# EAGLE design frankfurt_eth_arm (EAGLE 6.6.0)

## Sheet 1 of 3
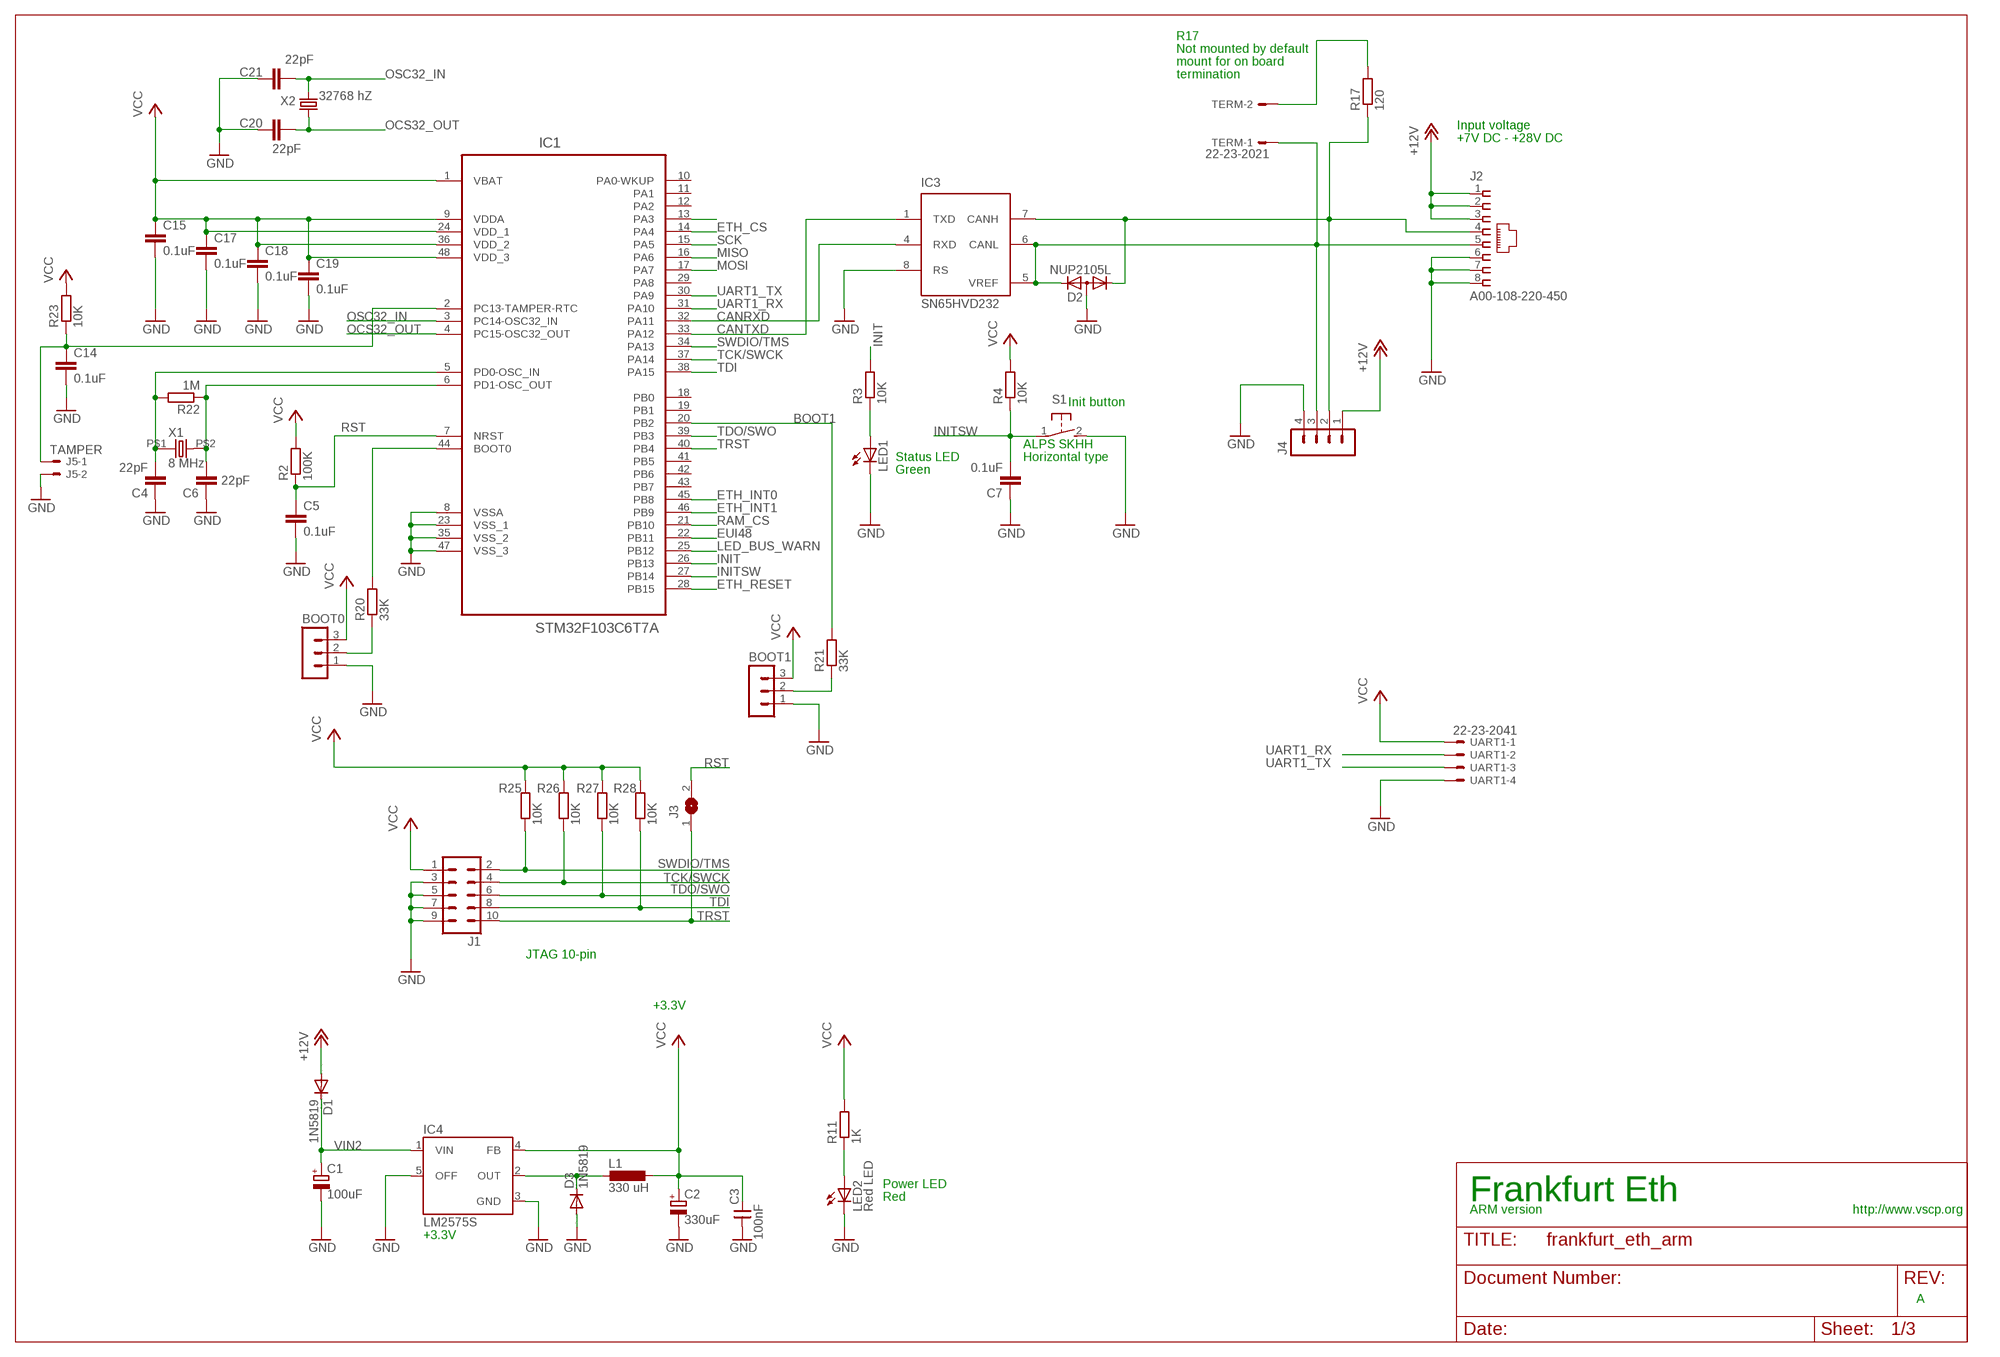
[diagram p0: schematic, sheet 1]

### Parts
BOOT0  MA03-1  [MA03-1]
BOOT1  MA03-1  [MA03-1]
C1  100uF  CPOL-EUD  [PANASONIC_D]
C2  330uF  CPOL-EUD  [PANASONIC_D]
C3  100nF  CNP-0805  [0805]
C4  22pF  C-EUC0805  [C0805]
C5  0.1uF  C-EUC0805  [C0805]
C6  22pF  C-EUC0805  [C0805]
C7  0.1uF  C-EUC0805  [C0805]
C14  0.1uF  C-EUC0805  [C0805]
C15  0.1uF  C-EUC0805  [C0805]
C17  0.1uF  C-EUC0805  [C0805]
C18  0.1uF  C-EUC0805  [C0805]
C19  0.1uF  C-EUC0805  [C0805]
C20  22pF  C-EUC0805  [C0805]
C21  22pF  C-EUC0805  [C0805]
D1  1N5819  DIODE-SOD123  [SOD123]
D2  NUP2105L  DIODE-2CA|ACSOT23  [SOT23]
D3  1N5819  DIODE-SOD123  [SOD123]
IC1  STM32F103C6T7A  [QFP50P900X900X160-48N]
IC3  SN65HVD232  MCP2551SN  [SO-08]
IC4  LM2575S  [TO263-5]
J1  MA05-2  [MA05-2]
J2  A00-108-220-450  [RJ-45]
J3  SJ  [SJ]
J4  MA04-1  [MA04-1]
J5  TAMPER  22-23-2021  [22-23-2021]
L1  330 uH  DO3316P  [DO3316P]
LED1  LEDCHIP-LED0805  [CHIP-LED0805]
LED2  Red LED  LEDCHIP-LED0805  [CHIP-LED0805]
R2  100K  R-EU_R0805  [R0805]
R3  10K  R-EU_R0805  [R0805]
R4  10K  R-EU_R0805  [R0805]
R11  1K  R-EU_R0805  [R0805]
R17  120  R-EU_R0805  [R0805]
R20  33K  R-EU_R0805  [R0805]
R21  33K  R-EU_R0805  [R0805]
R22  1M  R-EU_R0805  [R0805]
R23  10K  R-EU_R0805  [R0805]
R25  10K  R-EU_R0805  [R0805]
R26  10K  R-EU_R0805  [R0805]
R27  10K  R-EU_R0805  [R0805]
R28  10K  R-EU_R0805  [R0805]
S1  31-XX  [B3F-31XX]
TERM  22-23-2021  [22-23-2021]
UART1  22-23-2041  [22-23-2041]
X1  8 MHz  HC-49S  [9C]
X2  32768 hZ  CRYSTALTC26H  [TC26H]

### Nets
+12V: D1.A J2.1 J2.2 J2.3 J4.1
_BOOT0: BOOT0.2 R20.1
_BOOT1: BOOT1.2 R21.1
BOOT0: IC1.44(BOOT0) R20.2
BOOT1: IC1.20(PB2) R21.2
CANL: D2.2(K2) IC3.5(VREF) IC3.6(CANL) J2.5 J4.3 TERM.1
CANRXD: IC1.32(PA11) IC3.4(RXD)
CANTXD: IC1.33(PA12) IC3.1(TXD)
ETH_CS: IC1.14(PA4) ; also sheet 2
ETH_INT0: IC1.45(PB8) ; also sheet 2
ETH_INT1: IC1.46(PB9) ; also sheet 2
ETH_RESET: IC1.28(PB15) ; also sheet 2
EUI48: IC1.22(PB11) ; also sheet 3
GND: BOOT0.1 BOOT1.1 C1.- C2.- C3.1 C4.1 C5.2 C6.1 C7.1 C14.2 C15.2 C17.2 C18.2 C19.2 C20.1 C21.1 D2.3(A) D3.A IC1.8(VSSA) IC1.23(VSS_1) IC1.35(VSS_2) IC1.47(VSS_3) IC3.8(RS) IC4.3(GND) IC4.5(OFF) J1.3 J1.5 J1.7 J1.9 J2.6 J2.7 J2.8 J4.4 J5.2 LED1.C LED2.C S1.2(S) UART1.4 ; also sheet 2,3
INIT: IC1.26(PB13) R3.2
INITSW: C7.2 IC1.27(PB14) R4.1 S1.1(P)
LED_BUS_WARN: IC1.25(PB12)
MISO: IC1.16(PA6) ; also sheet 2,3
MOSI: IC1.17(PA7) ; also sheet 2,3
N$1: D3.C IC4.2(OUT) L1.1
N$2: C4.2 IC1.5(PD0-OSC_IN) R22.2 X1.P$1
N$5: LED1.A R3.1
N$7: C6.2 IC1.6(PD1-OSC_OUT) R22.1 X1.P$2
N$11: R17.2 TERM.2
N$20: LED2.A R11.1
N$22: D2.1(K1) IC3.7(CANH) J2.4 J4.2 R17.1
N$27: C14.1 IC1.2(PC13-TAMPER-RTC) J5.1 R23.1
OCS32_OUT: C20.2 IC1.4(PC15-OSC32_OUT) X2.1
OSC32_IN: C21.2 IC1.3(PC14-OSC32_IN) X2.2
RAM_CS: IC1.21(PB10) ; also sheet 3
ROM_CS1: IC1.13(PA3) ; also sheet 3
RST: C5.1 IC1.7(NRST) J3.2 R2.1
SCK: IC1.15(PA5) ; also sheet 2,3
SWDIO/TMS: IC1.34(PA13) J1.2 R25.1
TCK/SWCK: IC1.37(PA14) J1.4 R26.1
TDI: IC1.38(PA15) J1.8 R28.1
TDO/SWO: IC1.39(PB3) J1.6 R27.1
TRST: IC1.40(PB4) J1.10 J3.1
UART1_RX: IC1.31(PA10) UART1.2
UART1_TX: IC1.30(PA9) UART1.3
VCC: BOOT0.3 BOOT1.3 C2.+ C3.2 C15.1 C17.1 C18.1 C19.1 IC1.1(VBAT) IC1.9(VDDA) IC1.24(VDD_1) IC1.36(VDD_2) IC1.48(VDD_3) IC4.4(FB) J1.1 L1.2 R2.2 R4.2 R11.2 R23.2 R25.2 R26.2 R27.2 R28.2 UART1.1 ; also sheet 2,3
VIN2: C1.+ D1.C IC4.1(VIN)
Unconnected: IC1.10(PA0-WKUP) IC1.11(PA1) IC1.12(PA2) IC1.18(PB0) IC1.19(PB1) IC1.29(PA8) IC1.41(PB5) IC1.42(PB6) IC1.43(PB7)

### Notes on the sheet
- R17
- Not mounted by default
- mount for on board
- termination
- Input voltage
- +7V DC - +28V DC
- Init button
- ALPS SKHH
- Status LED | Horizontal type
- Green
- JTAG 10-pin
- +3.3V
- Power LED
- Red | Frankfurt Eth
- ARM version | http://www.vscp.org
- +3.3V
- A

## Sheet 2 of 3
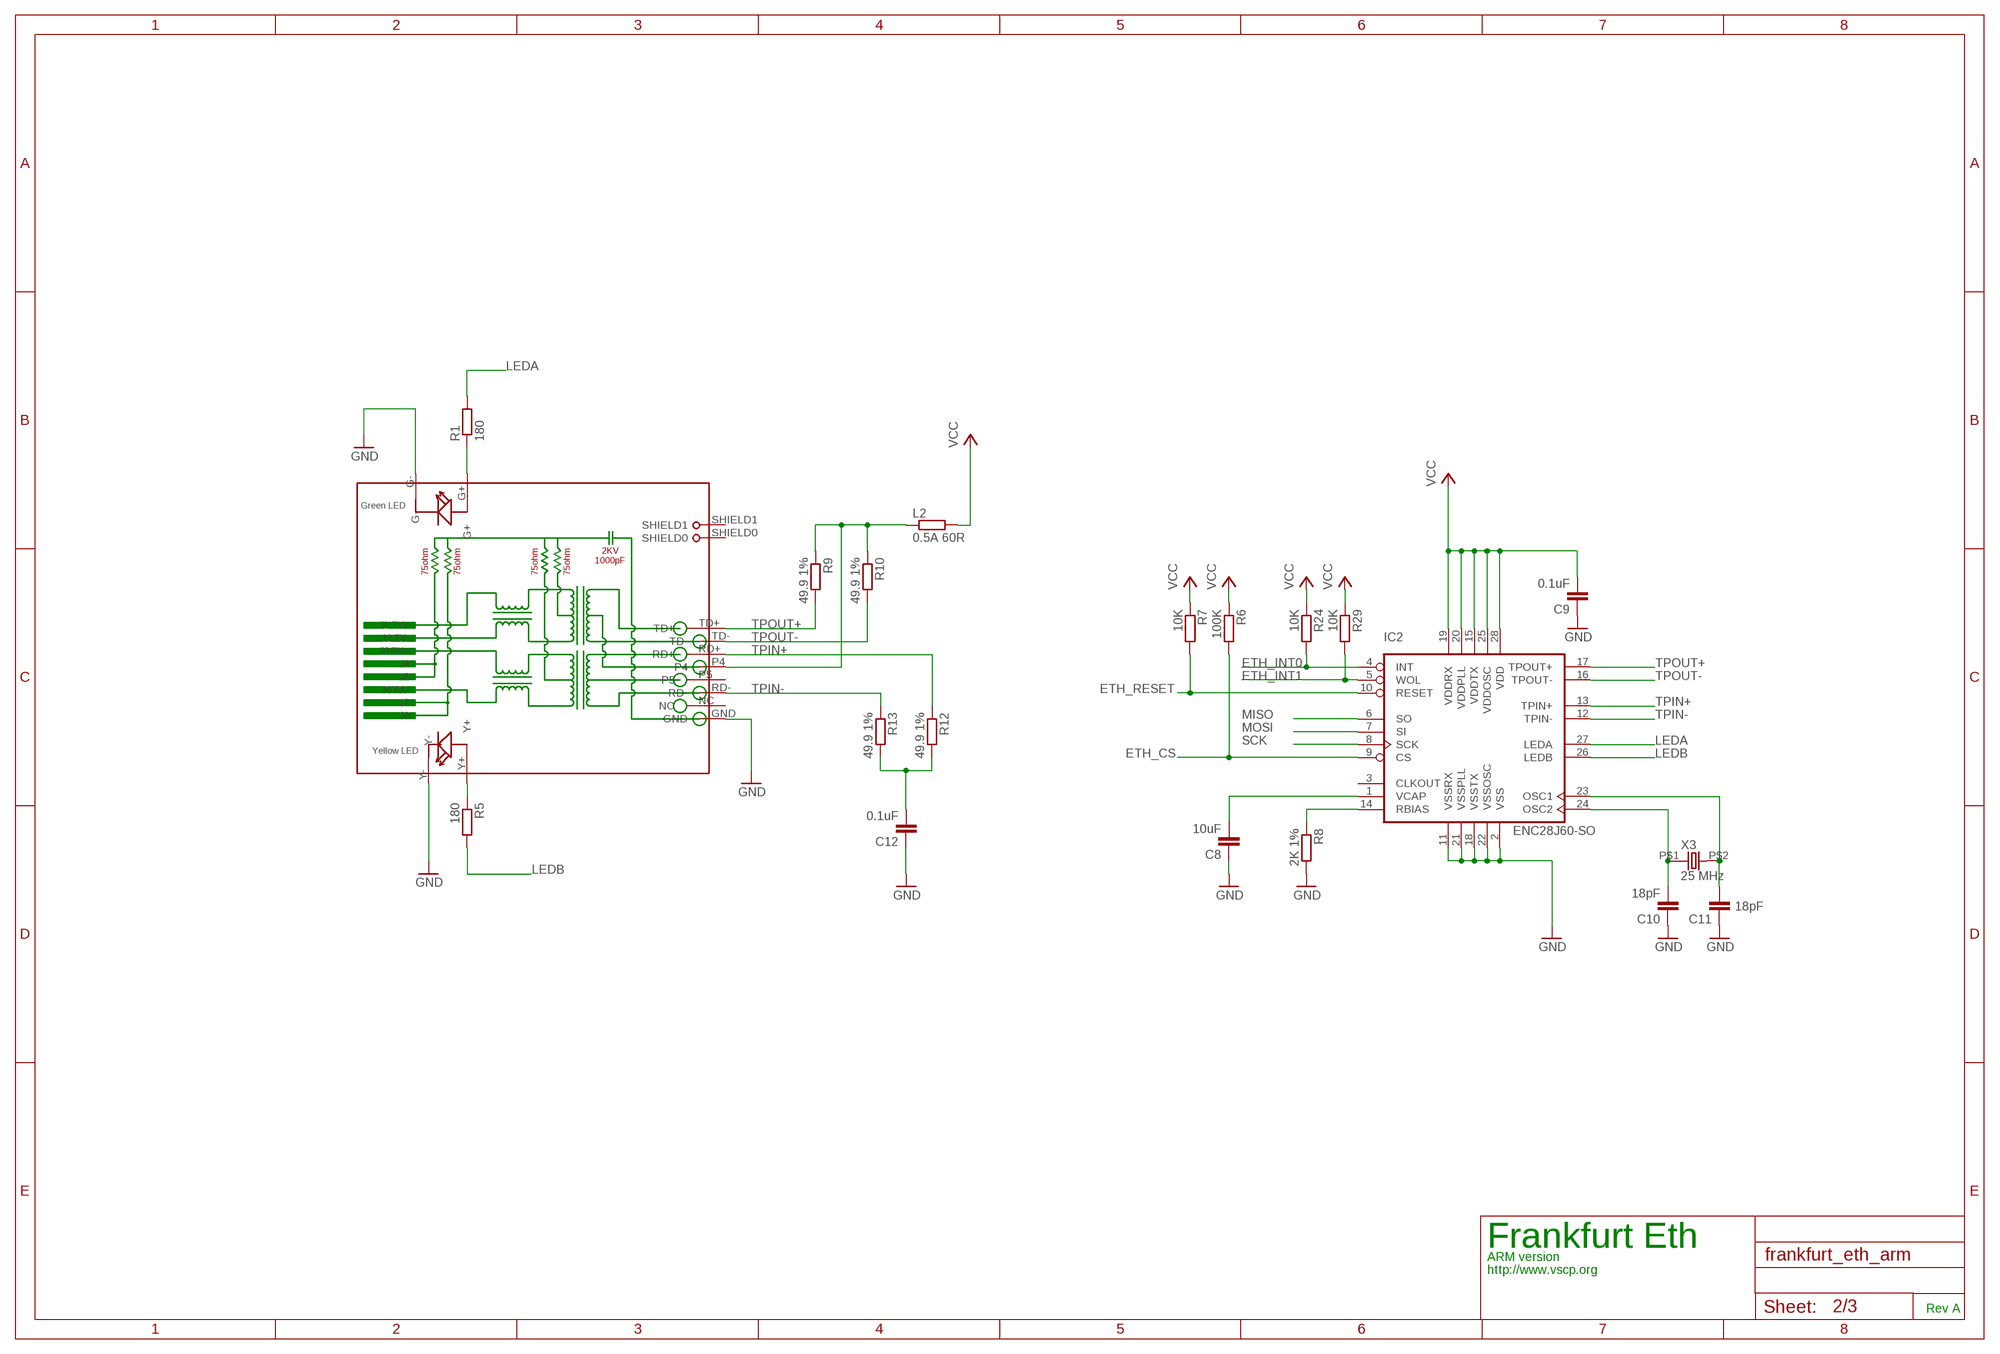
[diagram p1: schematic, sheet 2]

### Parts
C8  10uF  C-EUC0805  [C0805]
C9  0.1uF  C-EUC0805  [C0805]
C10  18pF  C-EUC0805  [C0805]
C11  18pF  C-EUC0805  [C0805]
C12  0.1uF  C-EUC0805  [C0805]
IC2  ENC28J60-SO  [SO28W]
L2  0.5A 60R  R-EU_R0805  [R0805]
R1  180  R-EU_R0805  [R0805]
R5  180  R-EU_R0805  [R0805]
R6  100K  R-EU_R0805  [R0805]
R7  10K  R-EU_R0805  [R0805]
R8  2K 1%  R-EU_R0805  [R0805]
R9  49.9 1%  R-EU_R0805  [R0805]
R10  49.9 1%  R-EU_R0805  [R0805]
R12  49.9 1%  R-EU_R0805  [R0805]
R13  49.9 1%  R-EU_R0805  [R0805]
R24  10K  R-EU_R0805  [R0805]
R29  10K  R-EU_R0805  [R0805]
RJ1  HR911105A  [HR911105A]
X3  25 MHz  HC-49S  [9C]

### Nets
ETH_CS: IC2.9(CS) R6.2 ; also sheet 1
ETH_INT0: IC2.4(INT) R24.2 ; also sheet 1
ETH_INT1: IC2.5(WOL) R29.2 ; also sheet 1
ETH_RESET: IC2.10(RESET) R7.2 ; also sheet 1
GND: C8.1 C9.1 C10.1 C11.1 C12.1 IC2.2(VSS) IC2.11(VSSRX) IC2.18(VSSTX) IC2.21(VSSPLL) IC2.22(VSSOSC) R8.2 RJ1.G- RJ1.GND RJ1.Y- ; also sheet 1,3
LEDA: IC2.27(LEDA) R1.2
LEDB: IC2.26(LEDB) R5.2
MISO: IC2.6(SO) ; also sheet 1,3
MOSI: IC2.7(SI) ; also sheet 1,3
N$8: R1.1 RJ1.G+
N$9: C8.2 IC2.1(VCAP)
N$10: R5.1 RJ1.Y+
N$13: IC2.14(RBIAS) R8.1
N$15: C10.2 IC2.24(OSC2) X3.P$1
N$16: C11.2 IC2.23(OSC1) X3.P$2
N$17: C12.2 R12.2 R13.2
N$19: L2.1 R9.1 R10.1 RJ1.P4
SCK: IC2.8(SCK) ; also sheet 1,3
TPIN+: IC2.13(TPIN+) R12.1 RJ1.RD+
TPIN-: IC2.12(TPIN-) R13.1 RJ1.RD-
TPOUT+: IC2.17(TPOUT+) R9.2 RJ1.TD+
TPOUT-: IC2.16(TPOUT-) R10.2 RJ1.TD-
VCC: C9.2 IC2.15(VDDTX) IC2.19(VDDRX) IC2.20(VDDPLL) IC2.25(VDDOSC) IC2.28(VDD) L2.2 R6.1 R7.1 R24.1 R29.1 ; also sheet 1,3
Unconnected: IC2.3(CLKOUT) RJ1.NC RJ1.P5 RJ1.SHIELD0 RJ1.SHIELD1

### Notes on the sheet
- Frankfurt Eth
- ARM version
- http://www.vscp.org
- Rev A

## Sheet 3 of 3
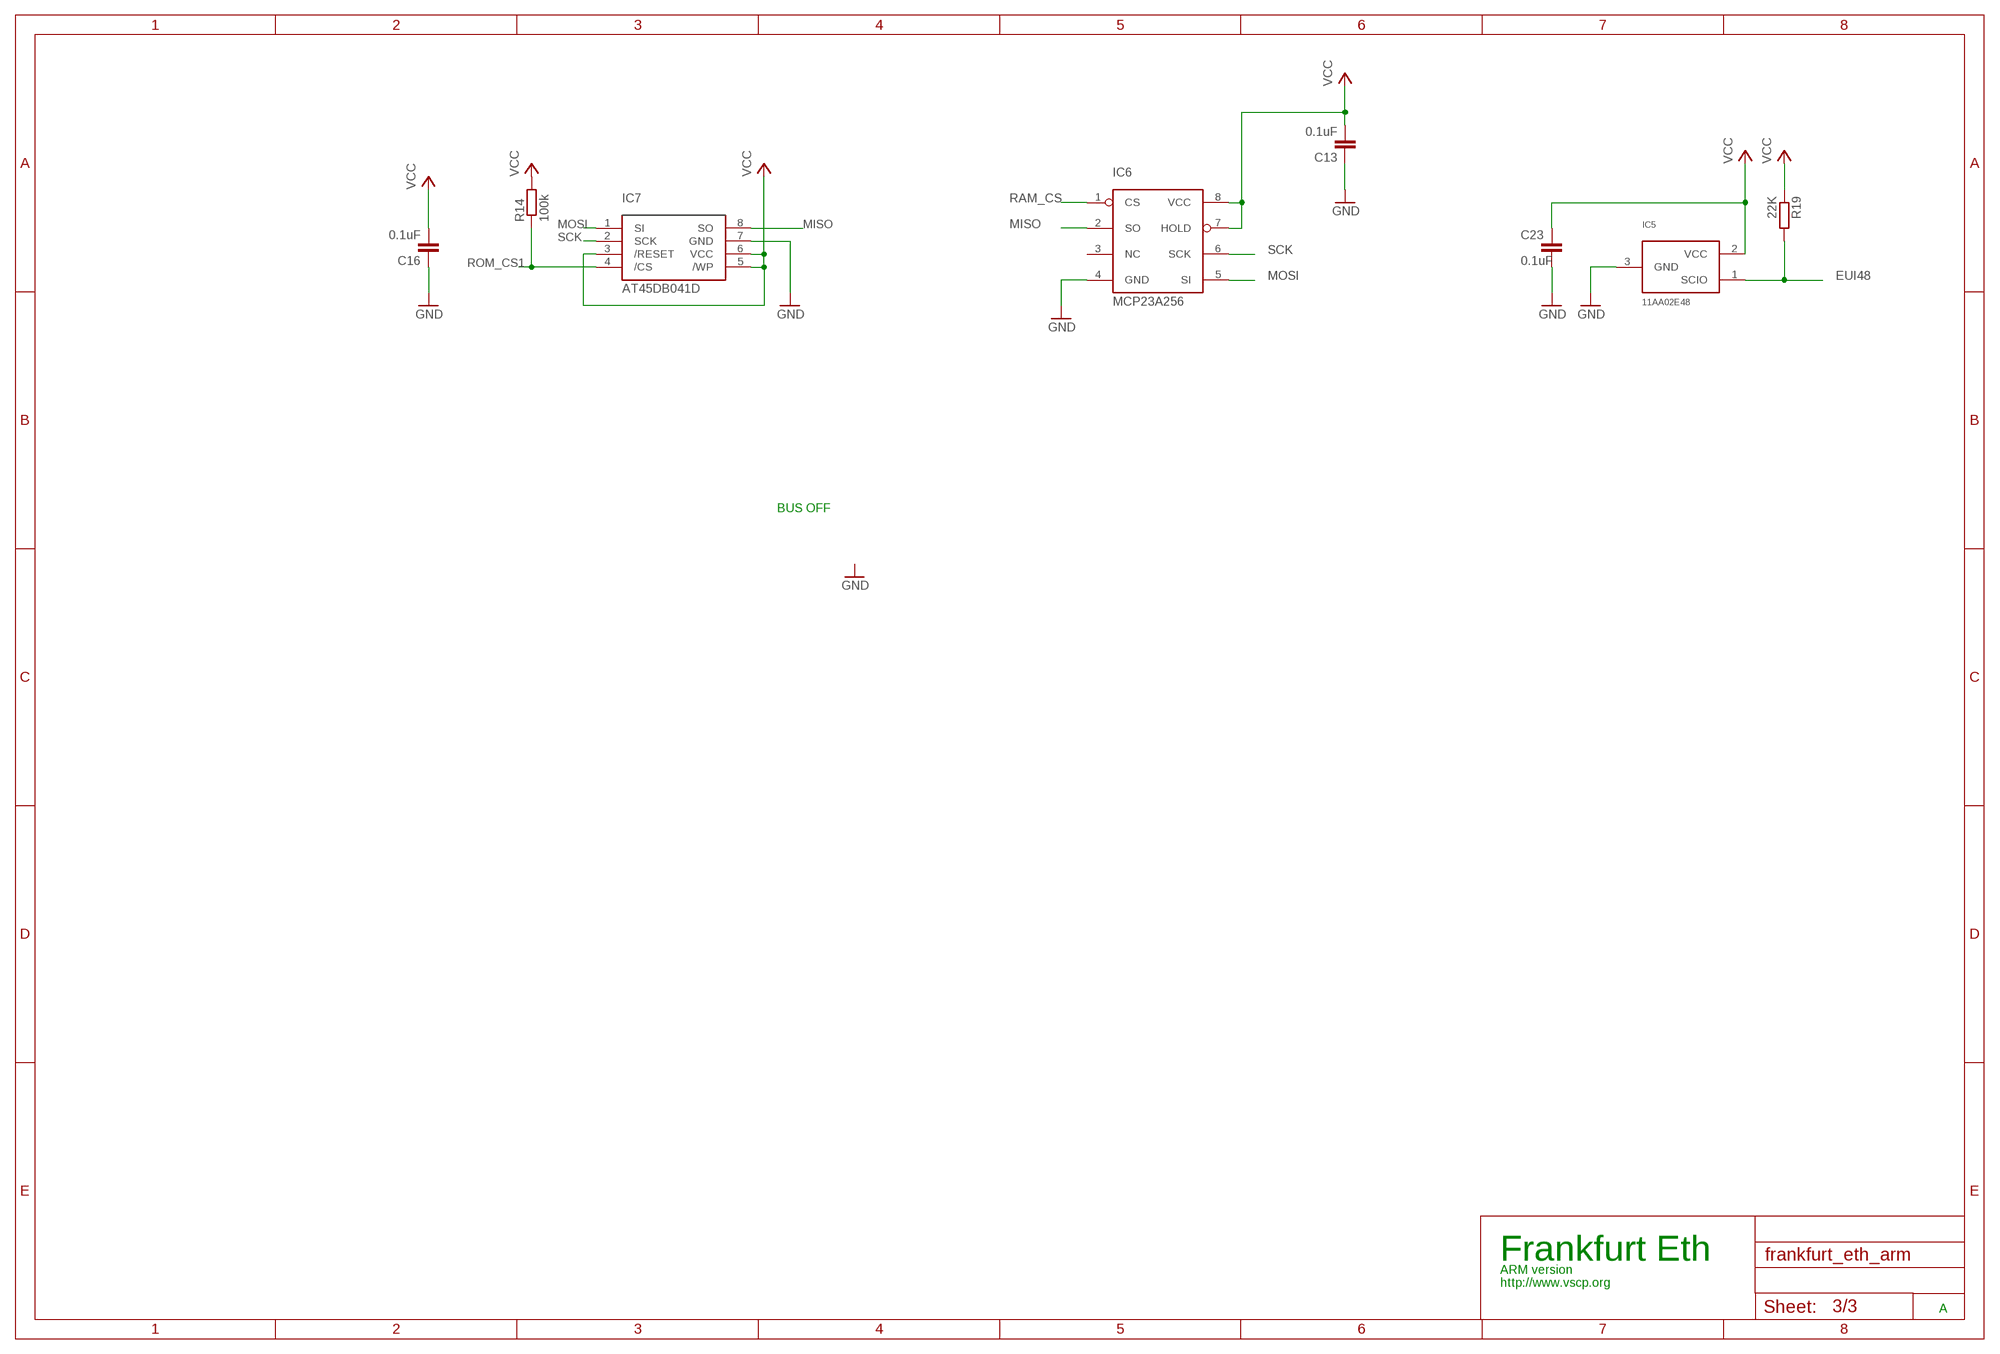
[diagram p2: schematic, sheet 3]

### Parts
C13  0.1uF  C-EUC0805  [C0805]
C16  0.1uF  C-EUC0805  [C0805]
C23  0.1uF  C-EUC0805  [C0805]
IC5  11AA02E48  [SOT23]
IC6  MCP23A256  [SO-8]
IC7  AT45DB041D  AT45DB011DSOP8W  [SOP8W]
R14  100k  R-EU_M0805  [M0805]
R19  22K  R-EU_M0805  [M0805]

### Nets
EUI48: IC5.1(SCIO) R19.2 ; also sheet 1
GND: C13.1 C16.1 C23.2 IC5.3(GND) IC6.4(GND) IC7.7(GND) ; also sheet 1,2
MISO: IC6.2(SO) IC7.8(SO) ; also sheet 1,2
MOSI: IC6.5(SI) IC7.1(SI) ; also sheet 1,2
RAM_CS: IC6.1(CS) ; also sheet 1
ROM_CS1: IC7.4(/CS) R14.1 ; also sheet 1
SCK: IC6.6(SCK) IC7.2(SCK) ; also sheet 1,2
VCC: C13.2 C16.2 C23.1 IC5.2(VCC) IC6.7(HOLD) IC6.8(VCC) IC7.3(/RESET) IC7.5(/WP) IC7.6(VCC) R14.2 R19.1 ; also sheet 1,2
Unconnected: IC6.3(NC)

### Notes on the sheet
- BUS OFF
- Frankfurt Eth
- ARM version
- http://www.vscp.org
- A

## Power pins joined to a net without a drawn wire
GND: IC3.2(VSS)
VCC: IC3.3(VDD)

## Library data of the parts
BOOT0 BOOT1 = con-lstb:MA03-1: PIN HEADER; OC_FARNELL: unknown; OC_NEWARK: unknown
C1 C2 = rcl:CPOL-EU: POLARIZED CAPACITOR, European symbol
C3 = cap-master:CNP-: NON-POLARIZED CAP
C4-C21 C23 = rcl:C-EU: CAPACITOR, European symbol
D1 D3 = diode:DIODE-: DIODE
D2 = diode:DIODE-2CA|AC: Dual DIODE Cathode-Anode|Anode-Cathode
IC1 = STM32F103C6T7A:STM32F103C6T7A: IC, MCU, 32BIT, 32KB FLASH, 48 LQFP; MPN: STM32F103C6T7A; OC_FARNELL: 2060890; OC_NEWARK: 65T3773; PACKAGE: 48LQFP; SUPPLIER: STMicroelectronics
IC2 = microchip_enet:ENC28J60-*: Microchip 10Mbit Eth. contoller with SPI interface
IC3 = microchip_can:MCP2551: High Speed CAN tranceiver
IC4 = v-reg-3:LM2575: National Semiconductor <http://www.national.com> 1.0A "Simple Switcher"(c) 52kHz, Vout 1.23-37V (HV: 57V), Vin 40V (HV: 60V), 50µA standby current
IC5 = snow:11AA02E48
IC6 = vscpcan:MCP23A256
IC7 = snow:AT45DB011D
J1 = con-lstb:MA05-2: PIN HEADER; OC_FARNELL: unknown; OC_NEWARK: unknown
J2 = vscpcan:A00-108-220-450
J3 = jumper:SJ: SMD solder JUMPER
J4 = con-lstb:MA04-1: PIN HEADER; OC_FARNELL: unknown; OC_NEWARK: unknown
J5 TERM = con-molex:22-23-2021: .100" (2.54mm) Center Header - 2 Pin; MF: MOLEX; MPN: 22-23-2021; OC_FARNELL: 1462926; OC_NEWARK: 25C3832
L1 = inductor-coilcraft:DO3316P: COILCRAFT; OC_FARNELL: unknown; OC_NEWARK: unknown
L2 R1-R14 R17 R19-R29 = rcl:R-EU_: RESISTOR, European symbol
LED1 LED2 = led:LED: LED OSRAM: - CHIPLED LG R971, LG N971, LY N971, LG Q971, LY Q971, LO R971, LY R971 LH N974, LH R974 LS Q976, LO Q976, LY Q976 LO Q996 - Hyper CHIPLED LW Q18S LB Q993, LB Q99A, LB R99A - SideLED LS A670, LO A670, LY A670, LG A670, LP A670 LB A673, LV A673, LT A673, LW A673 LH A674 LY A675 LS A676, LA A676, LO A676, LY A676, LW A676 LS A679, LY A679, LG A679 - Hyper Micro SIDELED® LS Y876, LA Y876, LO Y876, LY Y876 LT Y87S - SmartLED LW L88C, LW L88S LB L89C, LB L89S, LG L890 LS L89K, LO L89K, LY L89K LS L896, LA L896, LO L896, LY L896 - TOPLED LS T670, LO T670, LY T670, LG T670, LP T670 LSG T670, LSP T670, LSY T670, LOP T670, LYG T670 LG T671, LOG T671, LSG T671 LB T673, LV T673, LT T673, LW T673 LH T674 LS T676, LA T676, LO T676, LY T676, LB T676, LH T676, LSB T676, LW T676 LB T67C, LV T67C, LT T67C, LS T67K, LO T67K, LY T67K, LW E67C LS E67B, LA E67B, LO E67B, LY E67B, LB E67C, LV E67C, LT E67C LW T67C LS T679, LY T679, LG T679 LS T770, LO T770, LY T770, LG T770, LP T770 LB T773, LV T773, LT T773, LW T773 LH T774 LS E675, LA E675, LY E675, LS T675 LS T776, LA T776, LO T776, LY T776, LB T776 LHGB T686 LT T68C, LB T68C - Hyper Mini TOPLED® LB M676 - Mini TOPLED Santana® LG M470 LS M47K, LO M47K, LY M47K Source: http://www.osram.convergy.de LUXEON: - LUMILED® LXK2-PW12-R00, LXK2-PW12-S00, LXK2-PW14-U00, LXK2-PW14-V00 LXK2-PM12-R00, LXK2-PM12-S00, LXK2-PM14-U00 LXK2-PE12-Q00, LXK2-PE12-R00, LXK2-PE12-S00, LXK2-PE14-T00, LXK2-PE14-U00 LXK2-PB12-K00, LXK2-PB12-L00, LXK2-PB12-M00, LXK2-PB14-N00, LXK2-PB14-P00, LXK2-PB14-Q00 LXK2-PR12-L00, LXK2-PR12-M00, LXK2-PR14-Q00, LXK2-PR14-R00 LXK2-PD12-Q00, LXK2-PD12-R00, LXK2-PD12-S00 LXK2-PH12-R00, LXK2-PH12-S00 LXK2-PL12-P00, LXK2-PL12-Q00, LXK2-PL12-R00 Source: www.luxeon.com KINGBRIGHT: KA-3528ASYC Source: www.kingbright.com
RJ1 = hr911105a:HR911105A
S1 = switch-omron:31-XX: OMRON SWITCH; MPN: B3F-3100; OC_FARNELL: 959704; OC_NEWARK: 36M3582
UART1 = con-molex:22-23-2041: .100" (2.54mm) Center Header - 4 Pin; MF: MOLEX; MPN: 22-23-2041; OC_FARNELL: 1462920; OC_NEWARK: 38C0355
X1 X3 = vscpcan:HC-49S: Digikey 887-1050-1-nd
X2 = crystal:CRYSTAL: CRYSTAL; OC_FARNELL: unknown; OC_NEWARK: unknown

## Board
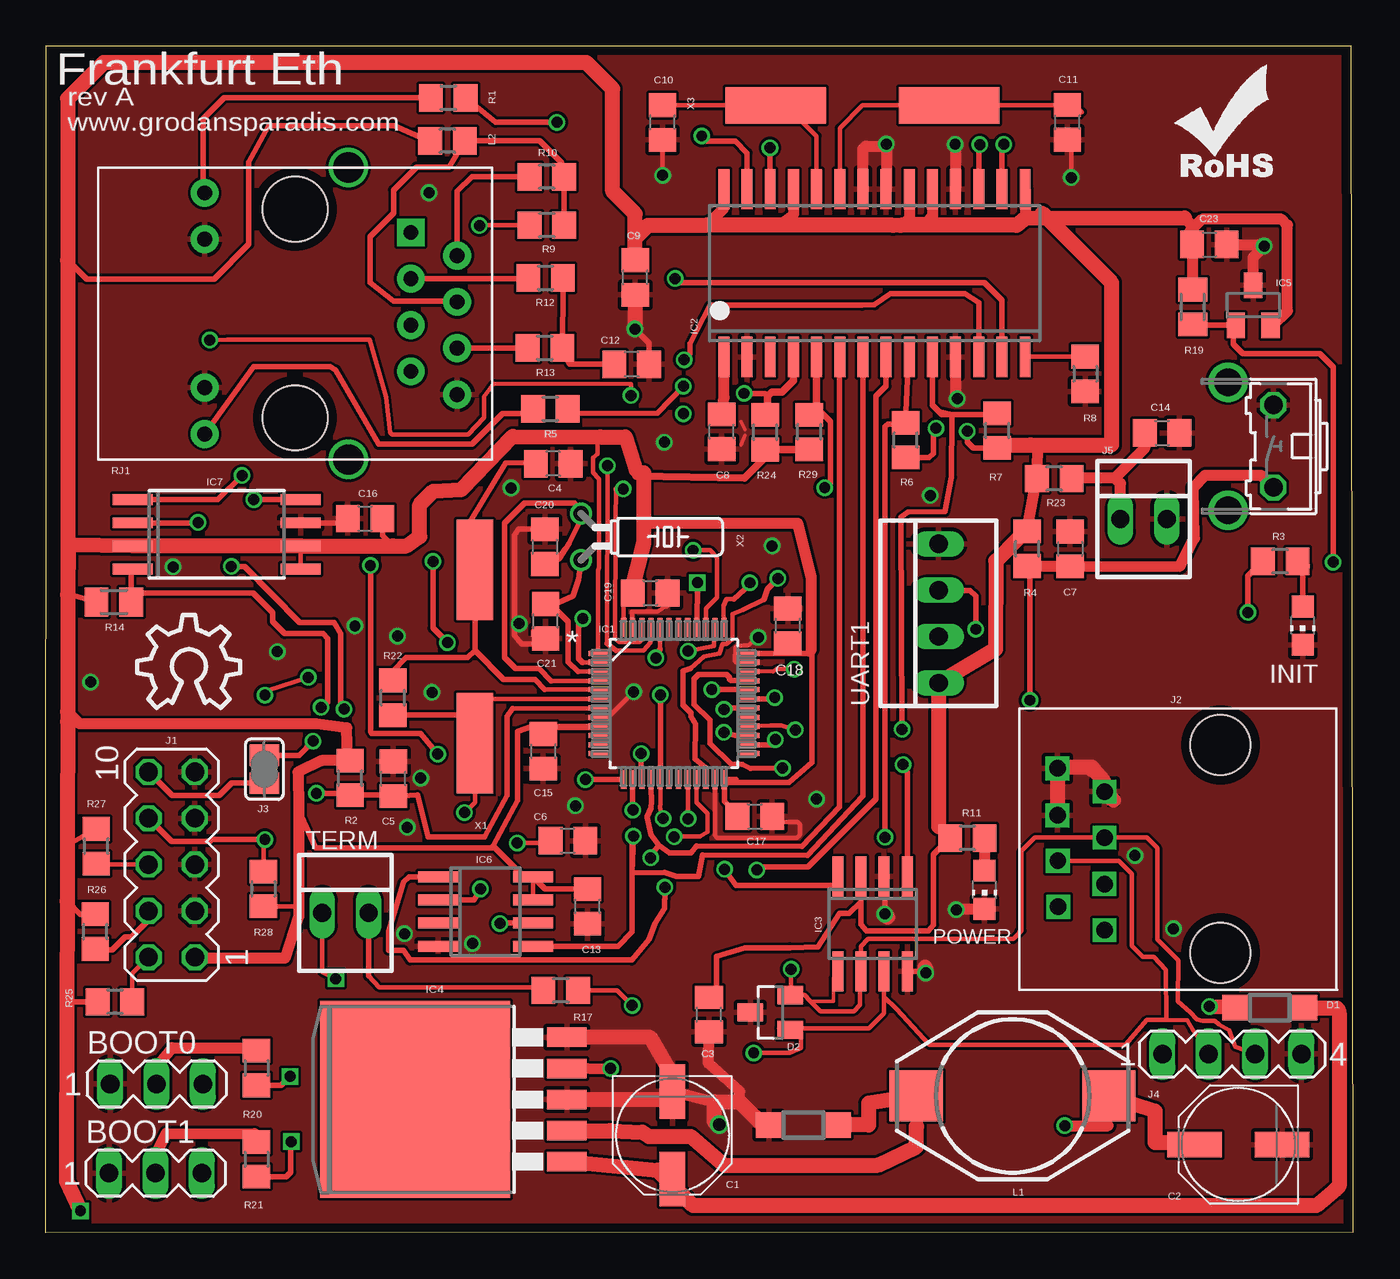
[diagram p3: board, top side]
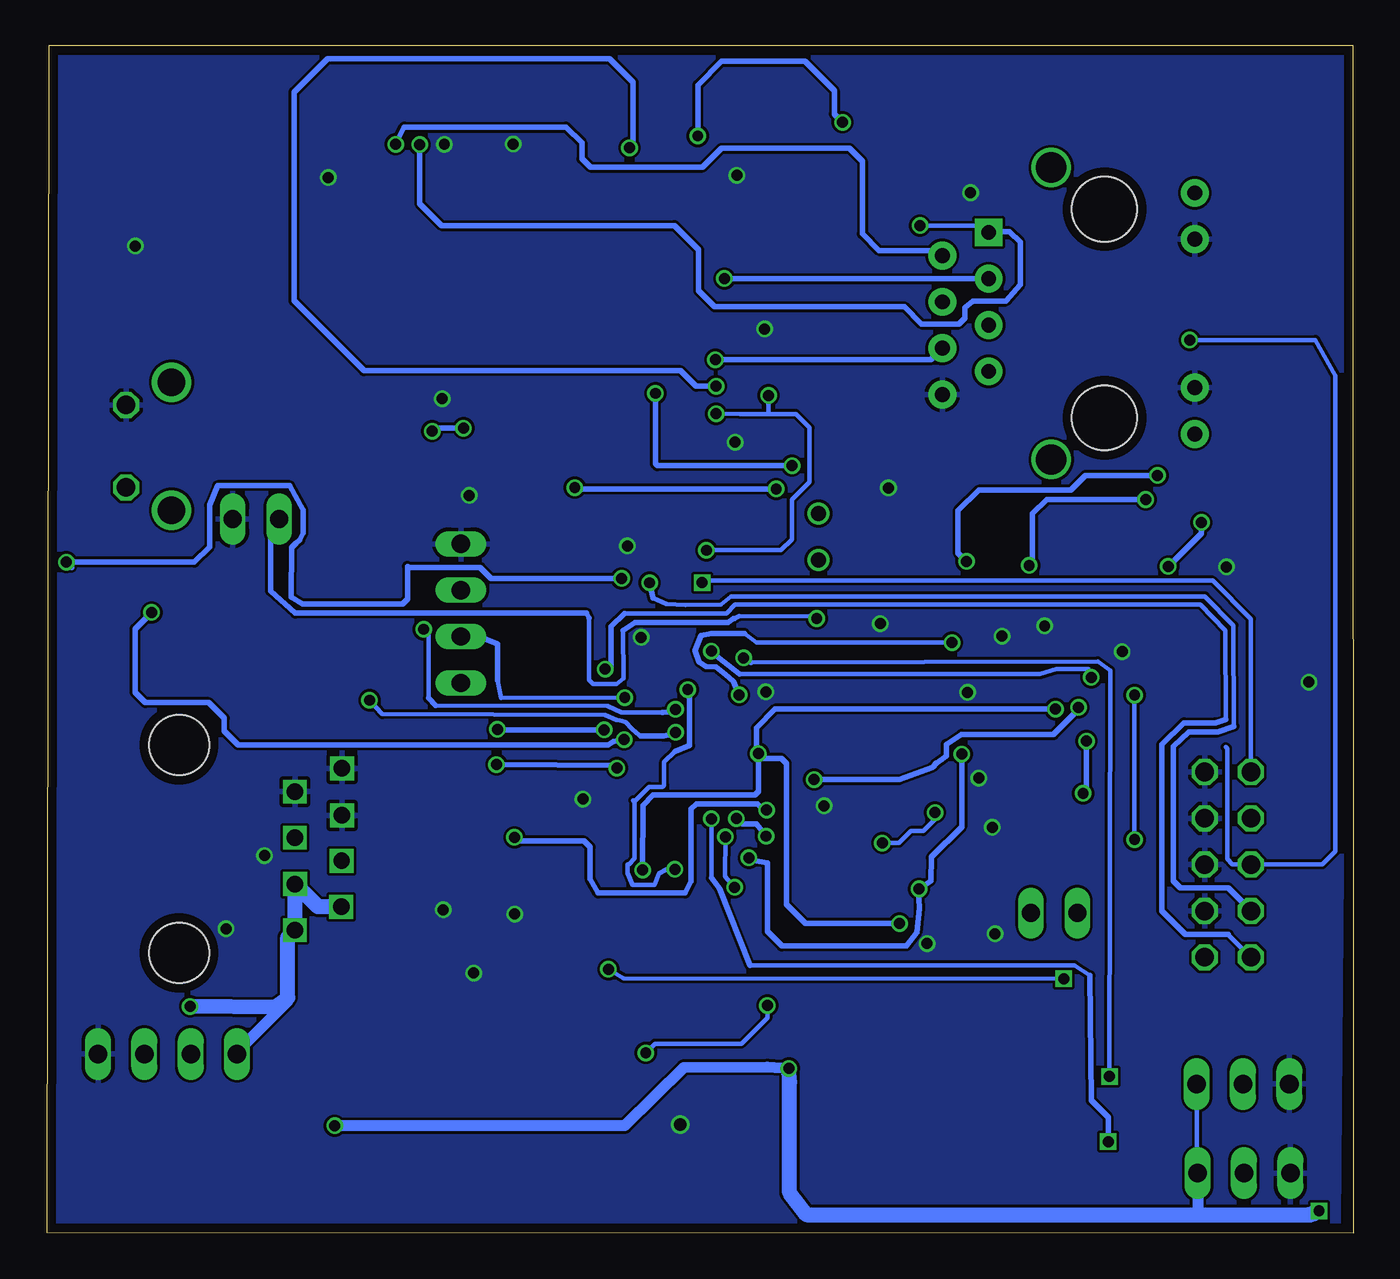
[diagram p4: board, bottom side, seen from below]

Size 71.65 x 65.08 mm. Coordinates in mm from the lower left corner, seen from the top.
Outline: 0,0 0.04,65.07 71.52,65.08 71.65,0.03 0,0
Copper layers (1*16): Top 0.035mm / dielectric 1.5mm / Bottom 0.035mm
Design rules "PCB-POOL": minimum track width 6mil, minimum drill 12mil, track to track 6mil, track to pad 6mil, pad to pad 6mil, via to via 6mil, smd to smd 6mil, copper to edge 20mil, drill to drill 8mil, minimum pad ring 8mil, minimum via ring 6mil, stop-mask expansion 3mil, vias tented up to drill 0mil, thermal gap 8mil

### Footprints (pad centres in the part's own frame; a part is rotated, then mirrored left to right if it is on the bottom)
MA03-1 = drill 1.016 long: 1 -2.54,0; 2 0,0; 3 2.54,0
PANASONIC_D = smd 3 x 1.4: + 2.4,0; - -2.4,0
0805 = smd 1.27 x 1.524: 1 -0.953,0; 2 0.953,0
C0805 = smd 1.3 x 1.5: 1 -0.95,0; 2 0.95,0
SOD123 = smd 1.4 x 1.4: A 1.9,0; C -1.9,0
SOT23 = smd 1 x 1.4: 1 -0.95,-1.1; 2 0.95,-1.1; 3 0,1.1
QFP50P900X900X160-48N = smd 1.041 x 0.279: 1 -4.166,2.743; 2 -4.166,2.261; 3 -4.166,1.753; 4 -4.166,1.245; 5 -4.166,0.762; 6 -4.166,0.254; 7 -4.166,-0.254; 8 -4.166,-0.762; 9 -4.166,-1.245; 10 -4.166,-1.753; 11 -4.166,-2.261; 12 -4.166,-2.743; 25 4.166,-2.743; 26 4.166,-2.261; 27 4.166,-1.753; 28 4.166,-1.245; 29 4.166,-0.762; 30 4.166,-0.254; 31 4.166,0.254; 32 4.166,0.762; 33 4.166,1.245; 34 4.166,1.753; 35 4.166,2.261; 36 4.166,2.743 | smd 0.279 x 1.041: 13 -2.743,-4.166; 14 -2.261,-4.166; 15 -1.753,-4.166; 16 -1.245,-4.166; 17 -0.762,-4.166; 18 -0.254,-4.166; 19 0.254,-4.166; 20 0.762,-4.166; 21 1.245,-4.166; 22 1.753,-4.166; 23 2.261,-4.166; 24 2.743,-4.166; 37 2.743,4.166; 38 2.261,4.166; 39 1.753,4.166; 40 1.245,4.166; 41 0.762,4.166; 42 0.254,4.166; 43 -0.254,4.166; 44 -0.762,4.166; 45 -1.245,4.166; 46 -1.753,4.166; 47 -2.261,4.166; 48 -2.743,4.166
SO28W = smd 0.6 x 2.2: 1 -8.255,-4.6; 2 -6.985,-4.6; 3 -5.715,-4.6; 4 -4.445,-4.6; 5 -3.175,-4.6; 6 -1.905,-4.6; 7 -0.635,-4.6; 8 0.635,-4.6; 9 1.905,-4.6; 10 3.175,-4.6; 11 4.445,-4.6; 12 5.715,-4.6; 13 6.985,-4.6; 14 8.255,-4.6; 15 8.255,4.6; 16 6.985,4.6; 17 5.715,4.6; 18 4.445,4.6; 19 3.175,4.6; 20 1.905,4.6; 21 0.635,4.6; 22 -0.635,4.6; 23 -1.905,4.6; 24 -3.175,4.6; 25 -4.445,4.6; 26 -5.715,4.6; 27 -6.985,4.6; 28 -8.255,4.6
SO-08 = smd 0.6 x 2.2: 1 -1.905,-2.6; 2 -0.635,-2.6; 3 0.635,-2.6; 4 1.905,-2.6; 5 1.905,2.6; 6 0.635,2.6; 7 -0.635,2.6; 8 -1.905,2.6
TO263-5 = smd 1.067 x 2.159: 1 -3.404,-5.791; 2 -1.702,-5.791; 3 0,-5.791; 4 1.702,-5.791; 5 3.404,-5.791 | smd 10.8 x 10.41: 6 0,2.54
SO-8 = smd 0.6 x 2.2: 1 -1.905,-2.6; 2 -0.635,-2.6; 3 0.635,-2.6; 4 1.905,-2.6; 5 1.905,2.6; 6 0.635,2.6; 7 -0.635,2.6; 8 -1.905,2.6
SOP8W = smd 2.2 x 0.6: 1 -4.6,1.905; 2 -4.6,0.635; 3 -4.6,-0.635; 4 -4.6,-1.905; 5 4.6,-1.905; 6 4.6,-0.635; 7 4.6,0.635; 8 4.6,1.905
MA05-2 = drill 1.016 octagon: 1 -5.08,-1.27; 2 -5.08,1.27; 3 -2.54,-1.27; 4 -2.54,1.27; 5 0,-1.27; 6 0,1.27; 7 2.54,-1.27; 8 2.54,1.27; 9 5.08,-1.27; 10 5.08,1.27
RJ-45 = drill 0.9 square: 1 -4.45,6.35; 2 -3.17,8.89; 3 -1.92,6.36; 4 -0.65,8.91; 5 0.62,6.35; 6 1.84,8.93; 7 3.14,6.35; 8 4.42,8.93 | hole 3.3: -5.7,0; 5.7,0
SJ = smd 1.168 x 1.6: 1 -0.762,0; 2 0.762,0
MA04-1 = drill 1.016 long: 1 -3.81,0; 2 -1.27,0; 3 1.27,0; 4 3.81,0
22-23-2021 = drill 1 long: 1 -1.27,0; 2 1.27,0
DO3316P = smd 2.92 x 2.79: 1 -5.28,0; 2 5.28,0
R0805 = smd 1.3 x 1.5: 1 -0.95,0; 2 0.95,0
CHIP-LED0805 = smd 1.2 x 1.2: A 0,-1.05; C 0,1.05
M0805 = smd 1.3 x 1.6: 1 -0.95,0; 2 0.95,0
HR911105A = drill 0.813 pad 1.524: G+ 4.953,-6.604; G- 4.953,-4.064; GND -8.89,4.445; NC -6.35,3.175; P4 -8.89,-0.635; P5 -6.35,0.635; RD+ -6.35,-1.905; RD- -8.89,1.905; TD- -8.89,-3.175; Y+ 4.953,6.604; Y- 4.953,4.064 | drill 1.651 pad 2.159: SHIELD0 -2.921,8.001; SHIELD1 -2.921,-8.001 | drill 0.813 pad 1.524 square: TD+ -6.35,-4.445 | hole 3.556: 0,-5.715; 0,5.715
B3F-31XX = drill 1.016 octagon: 1 -2.261,-1.245; 2 2.261,-1.245 | drill 1.499 pad 2.159: 3 -3.505,1.245; 4 3.505,1.245
22-23-2041 = drill 1 long: 1 -3.81,0; 2 -1.27,0; 3 1.27,0; 4 3.81,0
9C = smd 5.5 x 2: P$1 -4.74,0; P$2 4.76,0
TC26H = drill 0.813: 1 -1.27,0; 2 1.27,0

### Placement (x,y rotation side)
BOOT0  6.08,8.17 0 top
BOOT1  6.02,3.28 0 top
C1  34.35,5.35 270 top
C2  65.37,4.85 180 top
C3  36.35,11.97 90 top
C4  27.82,42.16 180 top
C5  19.05,24.89 90 top
C6  28.63,21.5 180 top
C7  56.15,37.5 270 top
C8  37.05,43.92 90 top
C9  32.31,52.37 90 top
C10  33.81,60.86 90 top
C11  56,60.87 90 top
C12  32.12,47.61 180 top
C13  29.7,17.9 90 top
C14  61.19,43.85 0 top
C15  27.27,26.4 270 top
C16  17.51,39.16 0 top
C17  38.87,22.83 0 top
C18  40.68,33.28 90 top
C19  33.13,35.08 0 top
C20  27.36,37.62 270 top
C21  27.4,33.53 90 top
C23  63.78,54.18 0 top
D1  67.1,12.35 180 top
D2  39.72,12.09 90 top
D3  41.54,5.92 180 top
IC1  34.43,29.02 0 top
IC2  45.43,52.62 0 top
IC3  45.32,16.94 180 top
IC4  22.78,7.32 90 top
IC5  66.18,50.85 0 top
IC6  24.11,17.62 270 top
IC7  9.38,38.29 0 top
J1  6.91,20.19 90 top
J2  64.39,21.05 90 top
J3  11.99,25.42 90 top
J4  65.02,9.81 0 top
J5  60.18,39.13 0 top
L1  53,7.51 0 top
L2  22.02,59.86 180 top
LED1  68.9,33.29 180 top
LED2  51.46,18.81 180 top
R1  22.07,62.22 0 top
R2  16.69,24.94 90 top
R3  67.66,36.82 180 top
R4  53.79,37.51 90 top
R5  27.66,45.17 0 top
R6  47.13,43.46 90 top
R7  52.15,43.98 90 top
R8  56.98,47.08 270 top
R9  27.47,55.24 180 top
R10  27.47,57.89 180 top
R11  50.52,21.65 180 top
R12  27.4,52.35 0 top
R13  27.37,48.51 0 top
R14  3.74,34.59 180 top
R17  28.23,13.3 180 top
R19  62.87,50.75 270 top
R20  11.56,9.05 270 top
R21  11.56,4.04 270 top
R22  19.03,29.33 90 top
R23  55.28,41.35 180 top
R24  39.44,43.89 90 top
R25  3.8,12.67 180 top
R26  2.72,16.52 90 top
R27  2.77,21.2 90 top
R28  11.94,18.86 270 top
R29  41.85,43.9 90 top
RJ1  13.67,50.4 180 top
S1  66.05,43.12 90 top
TERM  16.43,17.54 0 top
U$1  [ROHS_SILK]  63.98,60.29 0 top
U$2  [OSHW_10X200_NOTEXT]  5.01,28.78 0 top
UART1  48.94,33.96 90 top
X1  23.53,31.61 270 top
X2  29.34,38.16 270 top
X3  44.76,61.81 0 top

### Tracks (layer width: path | path; a pad name or v marks a point on that pad's centre or on a via)
+12V  (via drill 0.6)
  Top 0.813: v63.79,12.42 64.99,12.39 D1.A
  Bottom 0.203: 58.43,12.71 58.53,12.81
  Bottom 0.61: 58.43,12.71 60.97,10.17 J4.1
  Bottom 0.813: v63.79,12.42 59.15,12.37 58.53,12.81 58.43,12.91 58.43,16.21 J2.1 J2.3 56.78,17.88 J2.2
_BOOT0
  Top 0.61: BOOT0.2 6.08,9.13 6.93,10.15 11.54,10.15 R20.1
_BOOT1
  Top 0.61: BOOT1.2 6.02,4.3 6.63,5.47 11.45,5.45 R21.1
BOOT0  (via drill 0.6)
  Top 0.254: 33.66,32.01 33.66,33.18
  Top 0.305: R20.2 12.91,8.1 v13.39,8.58 | 33.48,31.51 v33.45,31.52 33.43,31.52 33.43,31.47 33.66,32.01 | 33.66,33.18 IC1.44
  Bottom 0.254: v13.39,8.58 13.36,30.84 14.04,31.33 33.04,31.26
  Bottom 0.305: 33.04,31.26 v33.45,31.52
BOOT1  (via drill 0.6)
  Top 0.254: v35.22,22.7 35.22,24.83
  Top 0.305: R21.2 13.19,3.09 13.44,3.34 13.44,4.99 v13.46,5.01 | 35.22,24.83 IC1.20
  Bottom 0.254: 14.47,14.12 15.31,14.68 33.09,14.66 | 35.22,19.45 v35.22,22.7
  Bottom 0.305: v13.46,5.01 13.46,6.33 14.4,7.27 14.47,14.12 | 33.09,14.66 34.77,18.88 35.22,19.45
CANL  (via drill 0.6)
  Top 0.203: 53.39,16.48 53.35,16.52 | 41.92,12.71 43.19,12.71 43.19,13.98 IC3.5
  Top 0.254: J4.3 65.2,10.21 65.08,10.55 64.87,11.1 64.3,11.44 64.07,11.64 63.4,11.63 63.09,11.72 62.74,12.1 62.06,12.7 62.07,14.94 60.93,16.08 60.93,21.1 60.36,21.67 J2.5 54.22,21.67 53.49,20.94 53.49,16.57 53.39,16.48 53.03,16.11 45.07,16.11 44.68,15.72 IC3.6 44.64,14.29 44.64,12.5 44.3,12.16 42.47,12.16 41.92,12.71 41.59,13.04 D2.2 40.86,13.08 v40.86,14.46 | TERM.1 15.15,14.32 v15.9,13.93
  Bottom 0.254: v15.9,13.93 40.02,13.96 v40.86,14.46
CANRXD  (via drill 0.6)
  Top 0.305: IC3.4 43.41,19.45 43.41,19.05 37.84,19.05 v37.21,19.93 | v36.51,29.78 37.36,29.8 37.36,29.79 38.54,29.78 IC1.32
  Bottom 0.254: v37.21,19.93 37.68,19.94 38.08,19.71 38.34,19.09 39.53,19.09 39.82,19.74 39.82,20.19 39.8,20.21 39.73,20.21 39.42,20.52 39.42,23.64 39.5,23.72 39.36,23.72 38.62,24.46 37.88,24.46 37.8,24.54 37.8,25.82 37.22,26.4
  Bottom 0.305: 37.22,26.4 36.41,26.71 36.41,29.53 v36.51,29.78
CANTXD  (via drill 0.6)
  Top 0.305: IC3.1 47.24,25.26 v46.99,25.67 | v40.39,25.48 38.62,25.47 38.18,25.69 37.55,25.7 36.41,26.84 36.41,28.11 35.54,28.98 35.54,30.37 35.78,30.61 37.33,30.61 37.48,30.46 37.48,30.34 37.55,30.27 IC1.33
  Bottom 0.305: v46.99,25.67 40.36,25.62 v40.39,25.48
ETH_CS  (via drill 0.6)
  Top 0.305: IC2.9 47.28,47.96 R6.2 47.23,44.34 46.16,44.34 46.01,44.19 v46.01,21.69 | IC1.14 32.17,23.28 v32.19,23.18
  Bottom 0.305: v32.19,23.18 32.41,23.26 32.68,23.53 36.04,23.53 36.32,23.25 36.32,19.27 36.65,18.64 41.42,18.64 41.86,19.42 41.86,21.15 42.19,21.48 45.8,21.48 v46.01,21.69
ETH_INT0  (via drill 0.6)
  Top 0.254: IC1.45 33.16,32.38 32.78,31.94 31.27,31.94 | 30.76,32.32 v30.79,42.06
  Top 0.305: 31.27,31.94 30.76,32.32 | v38.28,46.02 39.4,46.02 39.62,45.91
  Top 0.406: IC2.4 40.98,46.73 40.35,46.09 39.8,46.09 39.62,45.91 39.55,45.84 39.55,44.95 R24.2
  Bottom 0.305: v30.79,42.06 38.17,42.06 38.28,42.17 v38.28,46.02 38.28,46.06
ETH_INT1  (via drill 0.6)
  Top 0.254: 32.68,32.56 32.56,32.38 31.42,32.38 31.21,32.56 31.24,39.07 31.27,40.78
  Top 0.305: IC1.46 32.68,32.56 | 31.27,40.78 v31.66,40.78 | v42.7,40.85 42.79,40.85 43.02,41.08 43.02,44.48 42.25,45.25
  Top 0.406: R29.2 42.25,44.85 42.25,45.25 IC2.5
  Bottom 0.305: v31.66,40.78 42.63,40.78 v42.7,40.85
ETH_RESET  (via drill 0.6)
  Top 0.254: IC1.28 39.72,27.81 40.32,27.82 41.07,27.58
  Top 0.305: IC2.10 48.6,45.38 48.97,45.02 | 48.97,45.02 49.13,44.86 51.91,44.86 R7.2 | 41.07,27.58 v41.09,27.58 | v46.94,27.6 46.89,39.23 47.27,39.52 49.28,39.54 49.65,41.42 49.68,44.87 48.97,45.02
  Bottom 0.305: v41.09,27.58 46.91,27.58 v46.94,27.6
EUI48  (via drill 0.6)
  Top 0.254: 35.34,30.95 36.09,31.59 36.93,31.76 37.1,32.28 37.32,32.28 37.65,32.56 37.64,33.93 38.2,34.15 39.36,34.71
  Top 0.305: R19.2 62.92,49.75 IC5.1 65.1,49.62 65.1,48.72 65.61,48.21 69.83,48.21 70.57,47.47 v70.57,36.77 | IC1.22 36.18,25.48 35.6,25.99 35.62,27.91 35.38,28.32 35.38,28.49 34.93,28.94 34.93,30.8 35.34,30.95 | 39.36,34.71 39.56,35.31 v40.13,35.88
  Bottom 0.305: v40.13,35.88 47.28,35.88 47.88,36.48 51.82,36.48 51.87,36.53 51.87,34.76 52.15,34.48 57.62,34.48 58.25,34.87 58.22,37.58 57.98,37.82 57.78,37.98 57.59,38.36 57.59,39.62 58.32,40.96 62.28,40.96 62.72,39.89 62.72,37.6 63.55,36.77 v70.57,36.77 70.28,36.48
GND  (via drill 0.6, 0.7)
  Top 0.152: 27.95,38.42 27.95,38.11 C20.1
  Top 0.203: C21.1 26.68,33.03 26.68,32.73 | C20.1 26.68,38.11 26.68,38.72 | C8.1 36.84,43.19 37.2,42.82 | 38.11,44.46 38.33,44.04 | 38.11,43.19 38.33,43.74 | 48.27,40.65 v48.49,40.43
  Top 0.254: 36.64,7.19 36.64,7.37 | v33.82,57.97 C10.1 | v56.21,57.85 56.21,59.71 C11.1 | IC1.47 32.14,33.83 32.14,34.05 33.55,34.05 34.03,34.36 | IC1.23 36.69,21.78 36.81,21.66 41.19,21.66 41.35,21.82 41.35,22.4 41.22,22.53 40.12,22.53 C17.2 | IC1.35 37.85,31.28 37.77,31.36 37.8,32.08 37.88,32.18 38.51,32.22 v39.06,32.65 | IC1.8 30.83,28.26 v32.23,29.66
  Top 0.305: IC3.8 48.15,14.34 v48.24,14.25 | v45.99,17.48 45.99,19.51 IC3.2 | C12.1 33.07,48.78 v32.3,49.55 | 34.03,34.36 34.03,35.06 C19.2 | C20.1 25.93,38.57 25.69,38.26 25.69,32.74 26.08,32.28 27.1,32.28 C21.1 | IC7.7 16.33,38.92 C16.1
  Top 0.61: 34.06,7.33 34.34,6.66 34.63,7.22 34.66,7.19 | 34.66,7.19 34.71,7.14 | 34.66,7.19 C1.- | 39.43,5.79 39.34,5.89 D3.A 39.48,5.92 | C1.- 36.64,7.19 | 39.48,5.92 39.59,5.82 | 39.48,5.92 38.94,6.47 | 34.45,7.16 34.35,7.06 | C1.- 34.45,7.16 | 34.48,8.46 34.48,7.19 34.45,7.16 | 36.64,6.1 v36.92,5.95 | 38.03,7.19 38.03,7.75 37.15,8.57 36.32,9.3 C3.1 | 49.96,17.76 LED2.C | IC2.11 49.88,45.82 v49.97,45.73 | v49.85,59.67 49.87,59.31 49.89,57.26 | 49.88,57.25 IC2.18 | IC2.21 46.08,57.23 v46.08,59.68 45.98,59.58 44.97,59.58 44.79,59.41 IC2.22 | C23.2 66.7,54.18 v66.79,54.09 66.18,53.48 IC5.3
  Top 0.813: IC4.3 34.06,7.33 | 39.34,5.89 38.03,7.19 36.64,7.19 36.64,6.1 | IC4.5 33.15,10.72 34.48,8.46 | 58.52,23.71 J2.7 57.99,24.75 57.42,25.4 57.36,25.52 | 57.31,25.41 57.36,25.52 | 57.36,25.52 55.5,25.51 J2.8 J2.6 | 46.16,17.31 v45.99,17.48 | 48.21,14.58 v48.24,14.25 | C9.1 v32.31,49.56 v32.3,49.55 | C18.2 40.52,34.23 40.42,34.33
  Bottom 0.305: J4.4 69.17,10.43 69.27,10.34
  other vias: 49.91,17.71 19.82,22.24 29.04,23.41 21.17,29.63 12.7,31.86 19.28,32.72 61.81,16.68 59.71,20.69 6.99,36.51 16.95,33.27 23.39,15.87 19.67,16.4 20.56,24.94 39.82,37.66 25.95,33.4 2.47,30.2 42.26,23.78 25.51,40.84 33.91,43.34 21.01,57.02
  pour Top: 0.37,64.94 0.29,64.76 0.84,-0.95 71.97,-0.89 71.59,0.5 71.47,0.5 71.47,65.18 0.62,65.18 0.4,65.17
  pour Bottom: 0.37,65.18 0.32,65.18 0.86,0.5 71.59,0.5 71.59,65.18 1.38,65.2 1.2,65.19
INIT  (via drill 0.6)
  Top 0.305: IC1.26 39.37,26.76 39.84,26.76 v40,27.04 | v65.89,34.02 65.89,36 R3.2
  Bottom 0.305: v40,27.04 40.59,26.94 40.87,26.76 61.16,26.76 61.91,27.51 61.91,28.22 62.76,29.07 66.24,29.07 66.8,29.63 66.8,33.11 v65.89,34.02
INITSW  (via drill 0.6)
  Top 0.305: IC1.27 37.81,27.26 v37.17,27.44 | v53.95,29.2 53.95,36.4 R4.1
  Top 0.61: R4.1 56.07,36.56 C7.2 62.15,36.54 62.97,38.09 62.89,40.87 63.56,41.54 66.61,41.54 S1.1
  Bottom 0.254: 39.11,27.25 39.16,27.26 39.56,27.63 39.93,28.02 40.23,28.08 40.41,28.12 41.05,28.39 53.26,28.44 v53.95,29.2
  Bottom 0.305: v37.17,27.44 37.44,27.35 v37.18,27.43 37.55,27.31 37.85,27.24 39.11,27.25
LEDA  (via drill 0.6)
  Top 0.305: IC2.27 38.45,59.18 37.8,59.83 36.26,59.83 v35.96,60.13 | v28.03,60.88 24.66,60.88 R1.2
  Bottom 0.305: v35.96,60.13 35.96,62.92 34.66,64.22 30.08,64.22 28.48,62.62 28.48,61.33 v28.03,60.88
LEDB  (via drill 0.6)
  Top 0.305: v34.96,46.41 33.53,44.95 29.18,44.92 R5.2 | v39.7,59.48 39.7,57.23 IC2.26
  Bottom 0.305: v34.96,46.41 36.05,46.41 36.9,47.26 54.25,47.26 58.09,51.1 58.09,62.53 56.25,64.37 40.8,64.37 39.5,63.07 39.5,59.68 v39.7,59.48
MISO  (via drill 0.6)
  Top 0.305: 33.61,21.23 34.2,20.82 35.37,20.82 35.66,21.22 41.46,21.19 43.5,23.37 43.5,48 IC2.6 | 33.61,21.23 33.17,21.81 32.96,22.8 33.17,23.31 33.2,23.65 33.19,24.39 IC1.16 | IC6.2 23.5,18.26 v23.83,18.86 | IC7.8 v11.41,40.2 | v17.8,36.59 17.8,27.51 17.88,27.37 20.55,27.37 v21.49,26.25 | v33.16,20.56 33.16,20.73 33.58,21.21 33.59,21.21 33.61,21.23
  Bottom 0.305: v33.16,20.56 33.06,20.46 32.13,20.28 32.15,17.27 32.15,16.53 31.35,15.73 24.52,15.74 23.96,16.48 23.82,17.8 23.86,18.81 v23.83,18.86 23.87,18.83 23.19,19.31 23.16,20.58 23.15,20.6 21.49,22.26 v21.49,26.25 | v11.41,40.2 16.83,40.2 17.61,39.42 17.61,36.64 v17.8,36.59
MOSI  (via drill 0.6)
  Top 0.254: v33.85,22.72 33.68,23.3 33.69,23.6 33.69,24.83
  Top 0.305: 33.69,24.83 IC1.17 33.7,24.89 v33.7,29.5 | IC6.5 31.37,15.71 32.15,16.5 32.13,21.72 v32.21,21.75 32.13,19.74 33.92,19.77 34.59,19.55 35.77,19.55 35.99,20.71 41.75,20.69 44.79,23.96 IC2.7 | IC7.1 9.44,40.2 v10.76,41.52 | v21.23,36.81 21.23,33.15 v22.02,32.36
  Bottom 0.254: v22.02,32.36 32.74,32.36 33.41,32.87
  Bottom 0.305: v32.21,21.75 32.52,22.15 32.75,22.43 33.52,22.42 v33.85,22.72 | v10.76,41.52 14.71,41.52 15.51,40.72 20.56,40.72 21.69,39.59 21.69,37.27 v21.23,36.81 | 33.41,32.87 35.22,32.87 35.79,32.76 36.1,31.94 35.88,31.31 35.52,31.05 34.97,31.01 34.45,30.6 34,30.23 v33.7,29.5
N$1
  Top 0.61: 47.84,5.87 47.79,5.92 L1.1 47.72,5.82 | IC4.2 29.16,5.66 29.04,5.6
  Top 0.813: L1.1 45.1,7.12 45.1,5.92 D3.C | 47.72,5.82 47.73,5.82 47.73,4.73 45.61,3.71 37.17,3.71 35.36,5.3 33.07,5.3 32.71,5.53 30.93,5.61 28.62,5.61 29.16,5.66
N$2
  Top 0.254: 27.34,29.78 30.23,29.78
  Top 0.305: C4.2 26.73,42.23 25.21,42.19 23.32,39.08 23.31,37.17 23.47,36.24 X1.P$1 23.53,31.92 | 23.53,31.92 25.11,30.34 26.82,30.34 27.34,29.78 | 30.23,29.78 IC1.5 | R22.2 19.03,30.79 19.77,31.53 23.14,31.53 23.53,31.92
N$5
  Top 0.305: LED1.A 68.9,36.53
  Top 0.813: 68.9,36.53 R3.1
N$7  (via drill 0.6)
  Top 0.254: IC1.6 24.04,29.27 | X1.P$2 23.53,23.61 v22.96,23.04 | v25.85,21.37 27.63,21.37 C6.2
  Top 0.305: 24.04,29.27 23.66,28.89 23.66,27.54 | 23.66,27.54 23.66,26.98 X1.P$2 | R22.1 22.82,28.38 23.66,27.54
  Bottom 0.254: v22.96,23.04 22.96,22.67 23.6,22.03 24.29,22.03 24.93,21.39 25.83,21.39 v25.85,21.37
N$8
  Top 0.305: R1.1 9.78,62.22 8.64,61.08 8.64,57.08 RJ1.G+
N$9
  Top 0.61: C8.2 37.19,45.79 IC2.1
N$10
  Top 0.305: RJ1.Y+ 11.42,47.48 15.58,47.48 15.9,47.3 18.25,43.23 23.37,43.24 25.05,44.92 26.46,44.92 R5.1
N$11
  Top 0.254: 17.69,14.08 18.28,13.47 27.15,13.45 R17.2
  Top 0.305: 17.69,14.08 TERM.2
N$13
  Top 0.254: IC2.14 53.86,48.02 53.87,48.03 R8.1 | R8.1 57.4,48.03 57.58,47.85 57.16,47.85 R8.1
N$15
  Top 0.254: IC2.24 42.25,60.12 40.76,61.62 40.21,61.62 X3.P$1 C10.2
N$16
  Top 0.254: C11.2 56.38,61.44 56.8,61.44 56.43,61.81 X3.P$2 44.77,61.8 43.52,60.55 IC2.23
N$17
  Top 0.305: C12.2 28.72,47.61 R13.2 28.37,51.93 R12.2
N$19
  Top 0.305: R9.1 28.41,57.84 R10.1 28.27,57.99 28.27,58.67 27.08,59.86 L2.1 22.87,59.7 22.12,58.43 20.33,58.43 19.06,57.16 19.06,55.89 17.79,54.62 17.79,52.08 19.06,51.07 22.87,51.07 RJ1.P4
N$20
  Top 0.61: R11.1 LED2.A
N$22  (via drill 0.6)
  Top 0.254: 45.95,12.96 IC3.7 | 45.95,12.96 46.62,12.29 48.44,10.31 59.17,10.31 60.36,11.67 61.46,11.69 61.41,11.67 | 61.41,11.67 61.4,14.41 60.74,15.14 60.13,15.14 59.54,15.73 59.54,19.67 58.81,20.4 J2.4 | 61.41,11.67 62.57,11.66 62.87,11.13 J4.2 | 45.95,12.96 45.94,12.94 45.94,12.04 45.13,11.23 40.2,11.23 D2.1 41.39,11.19 41.39,10.15 40.77,9.87 v38.81,9.87 | R17.1 31.32,13.3 v32.15,12.47
  Top 0.305: IC3.7 45.93,14.31
  Bottom 0.254: v32.15,12.47 32.15,11.79 33.57,10.37 38.31,10.37 v38.81,9.87
N$27  (via drill 0.6)
  Top 0.254: IC1.2 29.44,31.28
  Top 0.305: 29.44,31.28 29.22,31.5 29.22,33.46 v29.44,33.68
  Top 0.61: J5.1 58.91,41.08 58.61,41.38 | 58.61,41.38 56.38,41.38 R23.1 | C14.1 60.24,43.01 58.61,41.38
  Bottom 0.254: 29.81,33.8 33.68,33.81 33.94,33.69 | 40.05,33.02 40.03,30.4 40.41,30.09 41.7,30.08 41.93,30.32 41.92,33.71
  Bottom 0.305: v29.44,33.68 29.47,33.71 29.81,33.8 | 33.94,33.69 34,33.68 34.3,33.46 39.4,33.46 40.05,33.02 | 41.92,33.71 42.05,33.98 58.02,33.98 59.38,35.2 59.38,38.66 J5.1
OCS32_OUT
  Top 0.254: IC1.4 27.71,30.27
  Top 0.305: C20.2 27.89,36.67 28.44,37.46 28.17,36.97 28.7,37.79 29.32,39.09 X2.1 29,40 26.24,40 25.15,38.91 25.15,31.54 25.76,30.93 27.05,30.93 27.71,30.27
OSC32_IN
  Top 0.254: IC1.3 29.17,30.77
  Top 0.305: X2.2 29.21,35.82 28.9,34.9 27.86,34.44 C21.2 27.83,34.05 28.09,34.05 28.63,33.51 28.63,31.31 29.17,30.77
RAM_CS  (via drill 0.6)
  Top 0.254: IC1.21 35.67,23.61 36.28,23 36.28,21.99 35.86,21.73 34.59,21.73 v34.45,21.72
  Top 0.305: v33.94,18.95 33.94,18.36 33.92,18.22 33.92,17.79 33.39,16.97 33.08,16.1 32.13,14.96 19.97,14.96 19.62,15.5 18.79,15.5 18.79,16.53 19.62,19.24 19.91,19.53 IC6.1
  Bottom 0.254: v33.94,18.95 34.46,19.55 34.45,21.74 v34.45,21.72
ROM_CS1  (via drill 0.6)
  Top 0.305: IC7.4 4.69,36.29 R14.1 4.76,35.08 11.38,35.08 12.44,34.02 12.44,33.51 13.1,32.85 15.21,32.85 15.47,32.59 15.47,29.07 15.19,28.79 v15.1,28.81 | IC1.13 29.71,24.85 v29.58,24.85
  Bottom 0.305: v29.58,24.85 24.92,24.85 23.1,25.53 22.96,25.68 | 22.96,25.68 22.88,25.76 | 22.96,25.68 23.03,25.58 22.98,25.64 22.96,25.68 | 22.96,25.68 22.34,26.16 22.34,26.79 21.51,27.33 16.47,27.32 15.18,28.61 15.1,28.79 v15.1,28.81
RST  (via drill 0.6)
  Top 0.254: 25.59,28.76 30.1,28.76
  Top 0.305: R2.1 17.22,24 | 17.22,24 19.03,24.02 C5.1 20.38,24 20.96,21.7 24.05,21.7 25.3,23.97 25.3,28.31 25.59,28.76 | 30.1,28.76 IC1.7 | J3.2 13.88,26.18 v14.66,26.96 | v14.84,24.1 17.12,24.1 17.22,24
  Bottom 0.305: v14.66,26.96 14.66,24.53 v14.84,24.1
SCK  (via drill 0.6)
  Top 0.305: v38.98,19.9 38.99,20.06 41.78,20.06 45.52,23.8 45.52,45.87 46.06,46.41 IC2.8 | v32.64,26.28 32.64,24.89 IC1.15 | IC6.6 24.93,16.99 v24.9,16.96 | IC7.2 8.33,38.92 v8.36,38.95 | v10.18,36.53 10.9,36.53 13.92,33.47 15.81,33.47 16.16,32.85 16.17,29.13 v16.35,28.71
  Bottom 0.305: v38.98,19.9 38.96,23.44 38.4,24 32.83,24 32.62,24.21 32.62,26.26 v32.64,26.28 | v24.9,16.96 30.05,16.96 31.1,18.01 31.1,25.74 31.38,26.02 32.38,26.02 v32.64,26.28 | v8.36,38.95 8.36,38.35 v10.18,36.53 | v16.35,28.71 31.72,28.71 32.75,27.68 32.75,26.39 v32.64,26.28
SWDIO/TMS  (via drill 0.6)
  Top 0.254: v41.04,30.91 40.06,30.91 39.86,30.79 38.67,30.8 | R25.1 4.75,14.22 J1.2
  Top 0.305: J1.2 5.64,15.13 | 38.67,30.8 IC1.34
  Bottom 0.254: 7.01,28.14 7.04,33.03 8.41,34.44 33.93,34.44 34.38,33.95 39.98,33.95 | 6.87,16.36 6.87,16.34 J1.2
  Bottom 0.305: 6.87,16.36 9.23,16.36 10.53,17.66 10.53,26.77 9.31,27.96 7.6,27.96 7.01,28.14 | 39.98,33.95 40.72,33.25 40.72,30.89 v41.04,30.91
TCK/SWCK  (via drill 0.6)
  Top 0.254: 37.72,34.75 37.32,34.75 37.16,34.36 IC1.37
  Top 0.305: J1.4 5.64,17.15 4.72,16.23 4.35,16.23 3.65,15.53 2.97,15.53 R26.1 | v38.6,35.64 38.61,35.54 37.72,34.75 | IC1.37
  Bottom 0.254: 6.57,27.77 6.6,33.3 8.16,34.89 34.14,34.88 34.69,34.45 36.62,34.43 37.68,34.47 38.42,34.79
  Bottom 0.305: J1.4 5.64,17.67 6.89,18.92 9.51,18.92 9.9,19.31 9.9,26.68 9.06,27.47 7.45,27.47 6.57,27.77 | 38.42,34.79 v38.6,35.64
TDI  (via drill 0.6)
  Top 0.254: IC1.38 36.62,32.17 v35.22,31.89 | v14.39,30.45 12.17,29.74 | R28.1 11.94,21.48 v12.02,21.56
  Top 0.305: 5.46,22.73 J1.8 6.92,21.45 8.99,21.45 9.1,21.56 v12.02,21.56 | 12.17,29.74 v12.02,29.48
  Bottom 0.254: 33.68,30.64 17.22,30.65 16.31,30.9 14.56,30.9 v14.39,30.45 | v12.02,29.48 v12.02,21.56
  Bottom 0.305: v35.22,31.89 35.17,31.83 33.68,30.64
TDO/SWO  (via drill 0.6)
  Top 0.254: R27.1 2.89,20.25 2.95,20.19 J1.6 | IC1.39 36.18,34.22 36.8,34.84 36.8,37.02 36.4,37.42 v35.49,37.42 | v9,48.95 9.95,48.97 17.76,48.97 18.66,45.82 18.88,43.88 19,43.75 23.15,43.75 24.03,44.68 24.03,45.85 24.56,46.55 32.09,46.53 v32.09,45.92 v32.08,45.91
  Bottom 0.254: 7.02,26.63 6.95,26.56 6.95,20.49 6.65,20.19 J1.6 5.62,20.21 1.73,20.21 1.02,20.92 1.02,47 2.11,48.95 v9,48.95 | v35.49,37.42 31.4,37.42 30.8,38.02 30.8,40.19 29.83,41.16 29.83,44.14 30.58,44.89 32.14,44.89 | 32.14,44.89 33.65,44.89 v34.96,44.9 | v32.08,45.91 32.08,44.95 32.14,44.89
  Bottom 0.305: 5.64,20.16 J1.6
TPIN+  (via drill 0.6)
  Top 0.305: RJ1.RD+ 25.95,52.3 R12.1 | IC2.13 52.41,51.13 51.45,52.1 34.71,52.1 v34.5,52.31
  Bottom 0.305: v34.5,52.31 RJ1.RD+
TPIN-  (via drill 0.6)
  Top 0.305: RJ1.RD- 25.91,48.49 R13.1 | IC2.12 51.14,50.99 50.39,51.48 46.3,51.48 45.43,50.88 45.43,50.89 44.75,50.85 36.42,50.85 35.33,48.75 35.33,48.2 v34.99,47.86
  Bottom 0.305: v34.99,47.86 23.2,47.86 RJ1.RD-
TPOUT+  (via drill 0.6)
  Top 0.254: R9.2 23.8,55.24 v23.78,55.22
  Top 0.305: IC2.17 51.14,59.56 v51.2,59.65
  Bottom 0.254: v23.78,55.22 20.4,55.22 RJ1.TD+
  Bottom 0.305: v51.2,59.65 51.2,56.42 50,55.22 37.24,55.22 35.91,53.89 35.91,51.64 35.04,50.77 24.64,50.77 23.69,49.82 21.66,49.82 21.33,50.15 21.33,50.73 20.87,51.08 19.08,51.08 18.29,51.98 18.29,54.3 18.87,54.88 19.99,54.88 RJ1.TD+
TPOUT-  (via drill 0.6)
  Top 0.305: RJ1.TD- 22.56,57.1 23.36,57.9 26.26,57.9 R10.2 | IC2.16 52.41,59.66 v52.51,59.67
  Bottom 0.305: v52.51,59.67 52.41,59.91 52.05,60.62 43.18,60.62 42.31,59.75 42.31,58.88 41.85,58.42 35.69,58.42 34.66,59.45 27.64,59.45 26.94,58.75 26.94,54.77 26.02,53.85 22.84,53.85 RJ1.TD-
TRST  (via drill 0.6)
  Top 0.305: v35.72,35.65 35.7,33.32 IC1.40 | J3.1 10.19,24.66 9.51,23.98 6.93,23.98 J1.10
  Bottom 0.254: J1.10 5.64,33.66 7.74,35.76 35.73,35.76
  Bottom 0.305: 35.73,35.76 v35.72,35.65
UART1_RX  (via drill 0.6)
  Top 0.305: IC1.31 39.56,29.27 v39.96,29.34
  Bottom 0.254: v39.96,29.34 46.75,29.33 46.94,30.27
  Bottom 0.305: 46.94,30.27 46.94,32.28 48.13,32.77 48.86,32.77 UART1.2
UART1_TX  (via drill 0.6)
  Top 0.305: IC1.30 37.43,28.77 v37.18,28.7 | v50.98,33.09 50.98,34.9 50.66,35.22 UART1.3
  Bottom 0.254: 37.88,28.53 40.13,28.54 40.9,28.89 50.34,28.92 | 50.72,29.32 50.72,32.83 v50.98,33.09
  Bottom 0.305: v37.18,28.7 37.51,28.55 37.88,28.53 | 50.34,28.92 50.72,29.32
VCC  (via drill 0.6)
  Top 0.203: 53.35,38.11 R4.2
  Top 0.254: IC6.8 IC6.7 | IC7.6 IC7.5 | IC1.36 40.11,31.76 | IC1.48 31.69,34.62 | IC1.1 30.26,36.31 30.34,36.47 30.34,41.31 29.99,41.68 29.99,42.51 30.25,42.69 30.25,43.48 30.4,43.64 | R28.2 13.59,17.91 13.87,17.63
  Top 0.305: v30.97,9.02 30.97,8.97 | 58.23,5.88 L1.2 | L2.2 20.97,59.86 19.1,60.69 12.22,60.69 11.13,58.69 11.13,54.19 9.23,52.29 2.24,52.29 1.21,53.32 | 54.62,55.89 54.62,55.64 | C3.2 36.78,13.35 36.78,15.16 38.34,15.62 40.43,15.62 40.79,15.64 42.32,15.68 43.52,17.51 44.04,17.51 44.68,18.16 IC3.3 44.68,16.92 45,16.56 48.38,16.56 48.67,16.89 48.67,20.75 R11.2 48.94,22.28 | C15.1 27.49,27.35 27.86,27.72 30.21,27.72 IC1.9 26.64,27.78 25.88,27.48 25.88,23.72 24.53,21.22 | C17.1 37.92,23 37.21,23.66 37.21,24.77 IC1.24 37.85,24.85 37.44,24.69 40.73,24.68 42,25.79 42,31.68 41.75,31.76 | 40.11,31.76 C18.1 | 31.69,34.62 C19.1 | IC1.36 41.75,31.76 | 41.75,31.76 41.97,31.98 | R2.2 15.14,25.89 | 15.12,25.89 16.56,25.92 | 24.53,21.22 24.47,21.12 14.81,21.12 13.87,23.16 | R26.2 1.9,17.47 1.18,18.19 | R27.2 1.39,21.38 1.19,22.39 | 2.9,27.79 2.78,27.91 | R25.2 1.22,12.67 1.16,12.61 | R14.2 1.25,35.01 1.21,34.97 | C16.2 18.46,38.23 19.03,37.66 | C13.2 27.39,18.85 IC6.8 26.22,19.53 24.53,21.22 | R6.1 48.42,42.49 48.65,42.72 48.65,43.96 v48.8,44.11 | v50.51,43.95 50.51,43.36 50.85,43.02 R7.1
  Top 0.406: 63.06,4.96 C2.+ | R24.1 R29.1 39.87,42.95 38.31,41.39 32.35,41.49 32.36,41.8
  Top 0.61: 30.97,8.97 IC4.4 | v55.86,5.88 58.23,5.88 | IC2.28 37.17,56.17 36.24,55.24 | 36.24,55.24 36.22,55.22 36.16,55.22 36.24,55.24 | 32.33,54.56 32.33,53.34 C9.2 | IC2.25 40.98,55.79 40.25,55.25 | IC2.20 47.34,55.57 46.86,55.23 46.59,55.23 46.35,55.24 46.44,55.22 | IC2.19 48.6,55.75 48.25,55.29 | IC2.15 53.68,55.62 | IC5.2 67.27,49.75 68.06,50.54 68.06,55.24 67.74,55.56 63.37,55.56 62.93,55.12 | 62.93,55.12 62.73,54.92 62.73,54.28 C23.1 62.87,54.14 R19.1 | 62.42,55.62 62.93,55.12 | 41.97,31.98 41.97,35.89 41.23,38.89 32.82,38.89 32.78,37.81 | 15.14,25.89 13.83,25.26 13.87,23.16 13.87,17.63 13.87,17.35 13.12,15.06 8.48,15.06 J1.1 | R2.2 15.12,25.89 | 16.56,25.92 16.5,27.69 14.85,27.9 2.78,27.91 1.86,27.91 1.21,28.56 | 53.99,43.19 54.38,42.84 R23.2 54.24,40.99 R4.2
  Top 0.813: L1.2 60.8,6.69 60.8,4.96 63.06,4.96 | 36.16,55.22 32.99,55.22 32.33,54.56 | 36.24,55.24 40.25,55.25 46.35,55.24 | 48.25,55.29 46.44,55.22 | 46.86,55.23 53.22,55.23 53.68,55.62 54.62,55.64 62.42,55.62 | C9.2 32.31,55.86 31.08,57.09 31.08,62.71 29.64,64.15 3.18,64.15 1.21,62.18 1.21,53.32 1.21,34.97 | 1.21,34.97 1.21,28.56 1.21,28.01 1.19,22.39 1.18,18.19 1.16,12.61 1.13,2.85 v1.91,1.21 | 54.62,55.89 58.43,52.08 58.43,43.19 53.99,43.19 52.08,43.19 R7.1 | 1.21,34.97 1.24,37.7 IC7.3 IC7.6 19.03,37.66 19.78,37.66 20.51,38.17 20.51,39.92 21.25,40.66 22.81,40.76 25.6,43.66 30.4,43.64 31.78,43.63 32.36,41.8 32.78,41.66 32.78,37.81 32.09,35.14 C19.1 | 48.94,22.28 UART1.1 49.54,30.49 52.06,32 52.08,36.84 53.35,38.11
  Bottom 0.254: BOOT0.3 8.62,3.34
  Bottom 0.305: 8.62,3.34 BOOT1.3 | 8.56,1.06 8.51,1.01 | v48.8,44.11 50.35,44.11 v50.51,43.95
  Bottom 0.61: v30.97,9.02 32.15,9.1 36.72,9.07 39.97,5.88 v55.86,5.88 | v1.91,1.21 2.26,1.21 2.46,1.01 | BOOT1.3 8.56,1.06
  Bottom 0.813: v30.97,9.02 30.93,8.26 30.93,2.21 30.01,1.01 8.51,1.01 2.46,1.01 2.31,1.01 v1.91,1.21
VIN2
  Top 0.406: 34.36,3.37 C1.+
  Top 0.813: IC4.1 33.54,3.45 | 33.54,3.45 34.36,3.37 | 33.54,3.45 35.49,1.5 69.64,1.5 70.71,2.4 70.89,2.58 70.89,12.06 70.78,12.34 D1.C

### Text on the board
tNames: Frankfurt Eth | rev A | www.grodansparadis.com | INIT | POWER